# Altium schematic sheet Pyro-Other.SchDoc: Pyro / Buzzer / CAN
size A4; SheetNumber: 6; SheetTotal: 6
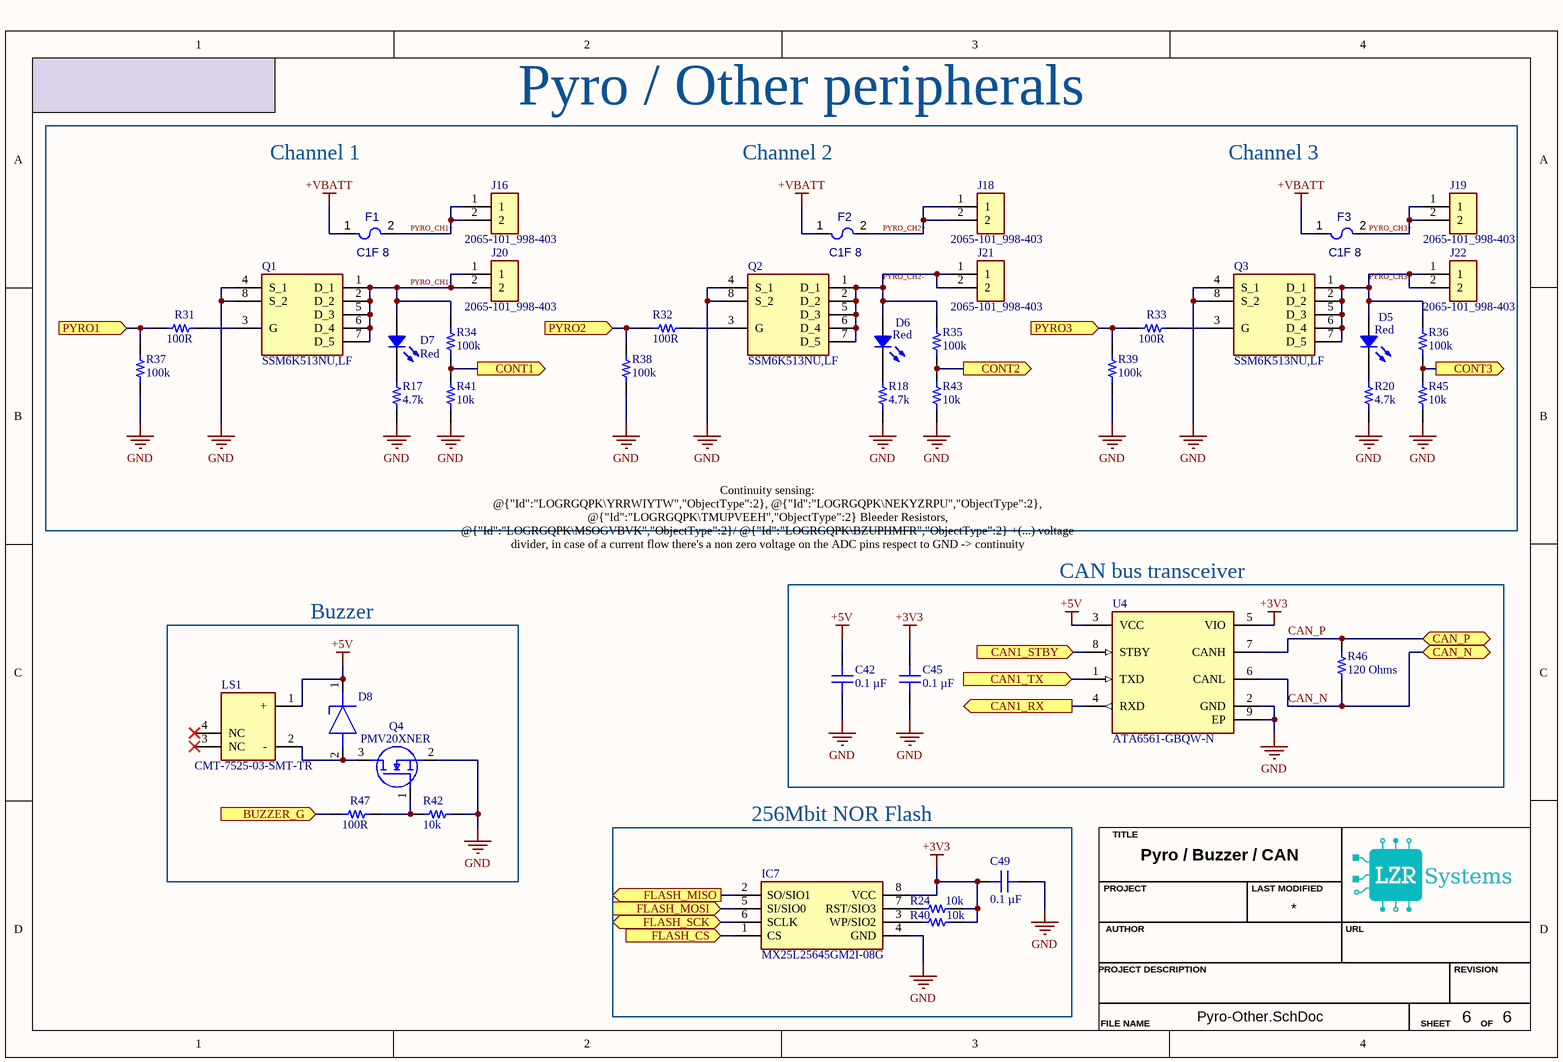
[diagram p0: Pyro-Other.SchDoc]

## Parts
C42  0.1 µF  [MURATA GCM155 0402_1005]
C45  0.1 µF  [MURATA GCM155 0402_1005]
C49  0.1 µF  [MURATA GCM155 0402_1005]
D5  Red  [LED 0402_1005 RED]
D6  Red  [LED 0402_1005 RED]
D7  Red  [LED 0402_1005 RED]
D8  PESD24VS1UA  [SOD2512X110N]  (value not drawn)
F1  C1F 8  [FP-3216FF-IPC_A]
F2  C1F 8  [FP-3216FF-IPC_A]
F3  C1F 8  [FP-3216FF-IPC_A]
IC7  MX25L25645GM2I-08G  [SOIC127P790X216-8N]
J16  2065-101_998-403  [2065101998403]
J18  2065-101_998-403  [2065101998403]
J19  2065-101_998-403  [2065101998403]
J20  2065-101_998-403  [2065101998403]
J21  2065-101_998-403  [2065101998403]
J22  2065-101_998-403  [2065101998403]
LS1  CMT-7525-03-SMT-TR  [CMT752503SMTTR]
Q1  SSM6K513NU,LF  [SSM6K513NULF]
Q2  SSM6K513NU,LF  [SSM6K513NULF]
Q3  SSM6K513NU,LF  [SSM6K513NULF]
Q4  PMV20XNER  [SOT95P230X110-3N]
R17  4.7k  [YAGEO RES 0402_1005]
R18  4.7k  [YAGEO RES 0402_1005]
R20  4.7k  [YAGEO RES 0402_1005]
R24  10k  [YAGEO RES 0402_1005]
R31  100R  [RES 0402_1005]
R32  100R  [RES 0402_1005]
R33  100R  [RES 0402_1005]
R34  100k  [YAGEO RES 0402_1005]
R35  100k  [YAGEO RES 0402_1005]
R36  100k  [YAGEO RES 0402_1005]
R37  100k  [YAGEO RES 0402_1005]
R38  100k  [YAGEO RES 0402_1005]
R39  100k  [YAGEO RES 0402_1005]
R40  10k  [YAGEO RES 0402_1005]
R41  10k  [YAGEO RES 0402_1005]
R42  10k  [YAGEO RES 0402_1005]
R43  10k  [YAGEO RES 0402_1005]
R45  10k  [YAGEO RES 0402_1005]
R46  120 Ohms  [KOA RES RK73 RN73 0603_1608]
R47  100R  [RES 0402_1005]
U4  ATA6561-GBQW-N  [FP-C04-21358-IPC_B]

## Blocks framed on the sheet
CAN bus transceiver: C42 C45 R46 U4
Buzzer: D8 LS1 Q4 R42 R47
256Mbit NOR Flash: C49 IC7 R24 R40

## Ports
BUZZER_G (in), CAN1_RX (out), CAN1_STBY (in), CAN1_TX (in), CAN_N (bidir), CAN_P (bidir), CONT1 (out), CONT2 (out), CONT3 (out), FLASH_CS (in), FLASH_MISO (out), FLASH_MOSI (in), FLASH_SCK (bidir), PYRO1 (in), PYRO2 (in), PYRO3 (in)

## Nets
+3V3: C45.1 C49.1 IC7.8(VCC) R24.1 R40.1 U4.5(VIO)
+5V: C42.1 D8.1(K) LS1.1(+) U4.3(VCC)
+VBATT: F1.1 F2.1 F3.1
GND: C42.2 C45.2 C49.2 IC7.4(GND) Q1.4(S_1) Q1.8(S_2) Q2.4(S_1) Q2.8(S_2) Q3.4(S_1) Q3.8(S_2) Q4.2(S) R17.1 R18.1 R20.1 R37.1 R38.1 R39.1 R41.1 R42.1 R43.1 R45.1 U4.2(GND) U4.9(EP)
BUZZER_G: R47.1 ; port BUZZER_G
CAN1_RX: U4.4(RXD) ; port CAN1_RX
CAN1_STBY: U4.8(STBY) ; port CAN1_STBY
CAN1_TX: U4.1(TXD) ; port CAN1_TX
CAN_N: R46.1 U4.6(CANL) ; port CAN_N
CAN_P: R46.2 U4.7(CANH) ; port CAN_P
CONT1: R34.1 R41.2 ; port CONT1
CONT2: R35.1 R43.2 ; port CONT2
CONT3: R36.1 R45.2 ; port CONT3
FLASH_CS: IC7.1(CS) ; port FLASH_CS
FLASH_MISO: IC7.2(SO/SIO1) ; port FLASH_MISO
FLASH_MOSI: IC7.5(SI/SIO0) ; port FLASH_MOSI
FLASH_SCK: IC7.6(SCLK) ; port FLASH_SCK
PYRO1: R31.1 R37.2 ; port PYRO1
PYRO2: R32.1 R38.2 ; port PYRO2
PYRO3: R33.1 R39.2 ; port PYRO3
PYRO_CH1+: F1.2 J16.1 J16.2
PYRO_CH1-: D7.1 J20.1 J20.2 Q1.1(D_1) Q1.2(D_2) Q1.5(D_3) Q1.6(D_4) Q1.7(D_5) R34.2
PYRO_CH2+: F2.2 J18.1 J18.2
PYRO_CH2-: D6.1 J21.1 J21.2 Q2.1(D_1) Q2.2(D_2) Q2.5(D_3) Q2.6(D_4) Q2.7(D_5) R35.2
PYRO_CH3+: F3.2 J19.1 J19.2
PYRO_CH3-: D5.1 J22.1 J22.2 Q3.1(D_1) Q3.2(D_2) Q3.5(D_3) Q3.6(D_4) Q3.7(D_5) R36.2
NetD5_2: D5.2 R20.2
NetD6_2: D6.2 R18.2
NetD7_2: D7.2 R17.2
NetD8_2: D8.2(A) LS1.2(-) Q4.3(D)
NetIC7_3: IC7.3(WP/SIO2) R40.2
NetIC7_7: IC7.7(RST/SIO3) R24.2
NetQ1_3: Q1.3(G) R31.2
NetQ2_3: Q2.3(G) R32.2
NetQ3_3: Q3.3(G) R33.2
NetQ4_1: Q4.1(G) R42.2 R47.2

Not connected (* = marked no-connect by the designer): LS1 3(NC)* 4(NC)*

## Notes on the sheet
- Pyro / Other peripherals
- Channel 1
- Channel 2
- Channel 3
- Continuity sensing:
  @{"Id":"LOGRGQPK\YRRWIYTW","ObjectType":2}, @{"Id":"LOGRGQPK\NEKYZRPU","ObjectType":2}, @{"Id":"LOGRGQPK\TMUPVEEH","ObjectType":2} Bleeder Resistors, @{"Id":"LOGRGQPK\MSOGVBVK","ObjectType":2}/ @{"Id":"LOGRGQPK\BZUPHMFR","ObjectType":2} +(...) voltage divider, in case of a current flow there's a non zero voltage on the ADC pins respect to GND -> continuity
- TITLE
- AUTHOR
- PROJECT
- LAST MODIFIED
- URL
- PROJECT DESCRIPTION
- REVISION
- FILE NAME
- SHEET
- OF

## Library data of the parts
C42 C45 C49 = GCM155R71H104ME02D: CAP CER 0.1UF 50V X7R 0402; manufacturer: Murata Electronics; Tolerance: ±20%; Part Number: GCM155R71H104ME02D; Capacitance: 0.1 µF; Applications: Automotive; componentlink1description: Datasheet; componentlink1url: https://psearch.en.murata.com/capacitor/product/GCM155R71H104ME02%23.pdf; componentlink2description: DigiKey Link; componentlink2url: https://www.digikey.com/en/products/detail/murata-electronics/GCM155R71H104ME02D/9867913; Device Package: 0402 (1005 Metric); lastupdated: 7/20/2024 2:04:19 AM; Lifecycle Status: Active; Minimum Order: 1; Mounting Type: Surface Mount, MLCC; Operating Temperature: -55°C ~ 125°C; Package / Case: 0402 (1005 Metric); packaging: TapeAndReel; partid: 39038; Part Status: Active; price: 0.01; Ratings: AEC-Q200; series: GCM; Size / Dimension: 0.039" L x 0.020" W (1.00mm x 0.50mm); Supplier 1: DigiKey; Supplier Part Number 1: 490-18204-1-ND; Temperature Coefficient: X7R; Thickness (Max): 0.022" (0.55mm); value: 0.1 µF; Voltage - Rated: 50V
D5-D7 = SM0402RC: LED RED CLEAR 0402 SMD; Manufacturer: Bivar Inc.; Configuration: 0402; Current - Test: 20mA; Lens Color: Colorless; Lens Size: 0.50mm x 1.00mm; Lens Style: Rectangle with Flat Top; Millicandela Rating: 90mcd; Viewing Angle: 130°; Voltage - Forward (Vf) (Typ): 2.1V; Wavelength - Dominant: 631nm; Wavelength - Peak: 645nm; Part Number: SM0402RC; Color: Red; ComponentLink1Description: Datasheet; ComponentLink1URL: https://www.bivar.com/Files/Datasheets/SM0402RC.pdf; ComponentLink2Description: DigiKey Link; ComponentLink2URL: https://www.digikey.com/en/products/detail/bivar-inc/SM0402RC/6810864; Device Package: 0402 (1005 Metric); Height (Max): 0.71mm; LastUpdated: 6/3/2024 7:59:17 PM; Lens Transparency: Clear; Lifecycle Status: Active; Minimum Order: 1; Mounting Type: Surface Mount; Package / Case: 0402 (1005 Metric); Packaging: TapeAndReel; PartId: 509; Part Status: Active; Price: 0.16; Series: -; Size / Dimension: 1.00mm L x 0.50mm W; Supplier 1: DigiKey; Supplier Part Number 1: 492-2208-1-ND; Supplier Device Package: 0402; Value: Red
D8 = PESD24VS1UA,115: Diode ESD (Uni-directional); Manufacturer_Name: Nexperia; Datasheet Link: https://assets.nexperia.com/documents/data-sheet/PESD24VS1UA.pdf; Height: 1.1mm; Manufacturer_Part_Number: PESD24VS1UA,115; Mouser Part Number: 771-PESD24VS1UA115; Mouser Price/Stock: https://www.mouser.co.uk/ProductDetail/Nexperia/PESD24VS1UA115?qs=A1cBxND5mHKZ%252BhkKKiwSEA%3D%3D; Arrow Part Number: PESD24VS1UA,115; Arrow Price/Stock: https://www.arrow.com/en/products/pesd24vs1ua115/nexperia
F1-F3 = CMP-005-00014-1: Fuse Chip Fast Acting 10A 24V SMD Solder Pad 1206 T/R CSA/UL/cULus; Case/Package: 1206; Current Rating: 10A; Pins: 2; Max Operating Temperature: 125°C; Min Operating Temperature: -55°C; Mounting Technology: Surface Mount
IC7 = MX25L25645GM2I-08G: Integrated Circuit; Manufacturer_Name: Macronix; Datasheet Link: https://www.farnell.com/datasheets/2815324.pdf; Height: 2.16mm; Manufacturer_Part_Number: MX25L25645GM2I-08G; Mouser Part Number: N/A; Mouser Price/Stock: https://www.mouser.co.uk/ProductDetail/Macronix/MX25L25645GM2I-08G?qs=Z%252BL2brAPG1Ifpgm4Amotqg%3D%3D; Arrow Part Number: MX25L25645GM2I-08G; Arrow Price/Stock: https://www.arrow.com/en/products/mx25l25645gm2i-08g/macronix-international?utm_currency=USD&region=nac
J16 J18-J22 = 2065-101_998-403: Connector; Manufacturer_Name: Wago; Manufacturer_Part_Number: 2065-101/998-403; Datasheet Link: https://www.farnell.com/datasheets/2849884.pdf?_gl=1*d6n7fb*_gcl_au*MTg5NzcyMzM3OS4xNzU0MjQ4OTUy; Height: 2.7mm
LS1 = CMT-7525-03-SMT-TR: Loudspeaker or Buzzer; Manufacturer_Name: Same Sky; Description: CMT-7525-03-SMT-TR - 7.5 mm; Datasheet Link: https://www.sameskydevices.com/product/resource/CMT-7525-03-SMT-TR.pdf; Height: 2.7mm; Manufacturer_Part_Number: CMT-7525-03-SMT-TR; Mouser Part Number: 179-CMT-7525-03SMTTR; Mouser Price/Stock: https://www.mouser.co.uk/ProductDetail/Same-Sky/CMT-7525-03-SMT-TR?qs=olJun0bQHM86ULzT6E8ouQ%3D%3D
Q1-Q3 = SSM6K513NU,LF: MOSFET (N-Channel); Manufacturer_Name: Toshiba; Datasheet Link: https://toshiba.semicon-storage.com/info/docget.jsp?did=53148&prodName=SSM6K513NU; Height: 0.8mm; Manufacturer_Part_Number: SSM6K513NU,LF; Mouser Part Number: 757-SSM6K513NULF; Mouser Price/Stock: https://www.mouser.co.uk/ProductDetail/Toshiba/SSM6K513NULF?qs=zPgndZZmKGbOGaIT7oO3Dw%3D%3D; Arrow Part Number: SSM6K513NU,LF; Arrow Price/Stock: https://www.arrow.com/en/products/ssm6k513nulf/toshiba?region=nac
Q4 = PMV20XNER: MOSFET (N-Channel); Manufacturer_Name: Nexperia; Datasheet Link: https://assets.nexperia.com/documents/data-sheet/PMV20XNE.pdf; Height: 1.1mm; Manufacturer_Part_Number: PMV20XNER; Mouser Part Number: 771-PMV20XNER; Mouser Price/Stock: https://www.mouser.co.uk/ProductDetail/Nexperia/PMV20XNER?qs=%252BRKXB2WKlSevPnXiP0DAaQ%3D%3D; Arrow Part Number: PMV20XNER; Arrow Price/Stock: https://www.arrow.com/en/products/pmv20xner/nexperia?utm_currency=USD&region=nac
R17 R18 R20 = AC0402FR-7W4K7L: RES 4.7K OHM 1% 1/8W 0402; Manufacturer: Yageo; Power (Watts): 0.125W, 1/8W; Resistance: 4.7 kOhms; Temperature Coefficient: ±100ppm/°C; Part Number: AC0402FR-7W4K7L; Value: 4.7k; ComponentLink1Description: Datasheet; ComponentLink1URL: https://www.yageo.com/upload/media/product/productsearch/datasheet/rchip/PYu-AC_51_RoHS_L_10.pdf; ComponentLink2Description: DigiKey Link; ComponentLink2URL: https://www.digikey.com/en/products/detail/yageo/AC0402FR-7W4K7L/17009027; Composition: Thick Film; Device Package: 0402 (1005 Metric); Features: Automotive AEC-Q200, Moisture Resistant; Height - Seated (Max): 0.015" (0.37mm); LastUpdated: 8/31/2025 3:03:39 PM; Lifecycle Status: Active; Minimum Order: 1; Number of Terminations: 2; Operating Temperature: -55°C ~ 155°C; Package / Case: 0402 (1005 Metric); Packaging: CutTape; PartId: 78681; Price: 0.01; Ratings: AEC-Q200; Series: AC; Size / Dimension: 0.039" L x 0.020" W (1.00mm x 0.50mm); Supplier 1: DigiKey; Supplier Part Number 1: 13-AC0402FR-7W4K7LCT-ND; Supplier Device Package: 0402; Tolerance: ±1%
R24 R40-R43 R45 = AC0402FR-1310KL: RES 10K OHM 1% 1/16W 0402; Manufacturer: Yageo; Power (Watts): 0.063W, 1/16W; Resistance: 10 kOhms; Temperature Coefficient: ±100ppm/°C; Part Number: AC0402FR-1310KL; Value: 10k; ComponentLink1Description: Datasheet; ComponentLink1URL: https://www.yageo.com/upload/media/product/productsearch/datasheet/rchip/PYu-AC_51_RoHS_L_8.pdf; ComponentLink2Description: DigiKey Link; ComponentLink2URL: https://www.digikey.com/en/products/detail/yageo/AC0402FR-1310KL/12756397; Composition: Thick Film; Device Package: 0402 (1005 Metric); Features: Automotive AEC-Q200, Moisture Resistant; Height - Seated (Max): 0.015" (0.37mm); LastUpdated: 8/31/2025 3:03:46 PM; Lifecycle Status: Active; Minimum Order: 1; Number of Terminations: 2; Operating Temperature: -55°C ~ 155°C; Package / Case: 0402 (1005 Metric); Packaging: CutTape; PartId: 69220; Part Status: Active; Price: 0.01; Ratings: AEC-Q200; Series: AC; Size / Dimension: 0.039" L x 0.020" W (1.00mm x 0.50mm); Supplier 1: DigiKey; Supplier Part Number 1: 13-AC0402FR-1310KLCT-ND; Supplier Device Package: 0402; Tolerance: ±1%
R31-R33 R47 = 504L1000FTNCFT: RES SMD 100 OHM 1% 1/8W 0402; Manufacturer: American Technical Ceramics; Power (Watts): 0.125W, 1/8W; Resistance: 100 Ohms; Temperature Coefficient: -50/ -150ppm/°C; Part Number: 504L1000FTNCFT; Value: 100R; ComponentLink1Description: Datasheet; ComponentLink1URL: http://www.atceramics.com/UserFiles/504L_ubr_resistor.pdf; ComponentLink2Description: DigiKey Link; ComponentLink2URL: http://digikey.com/product-detail/en/american-technical-ceramics/504L1000FTNCFT/1284-1327-1-ND/4789907; Composition: Thin Film; Device Package: 0402 (1005 Metric); Features: RF, High Frequency; Height - Seated (Max): 0.024" (0.60mm); LastUpdated: 2/9/2024 8:30:03 PM; Lifecycle Status: Active; Minimum Order: 1; Number of Terminations: 2; Operating Temperature: -40°C ~ 125°C; Package / Case: 0402 (1005 Metric); Packaging: TapeAndReel; PartId: 7485; Part Status: Active; Price: 1.53; Series: ATC504; Size / Dimension: 0.039" L x 0.020" W (1.00mm x 0.50mm); Supplier 1: DigiKey; Supplier Part Number 1: 1284-1327-1-ND; Supplier Device Package: 0402; Tolerance: ±1%
R34-R39 = AC0402FR-13100KL: RES 100K OHM 1% 1/16W 0402; Manufacturer: Yageo; Power (Watts): 0.063W, 1/16W; Resistance: 100 kOhms; Temperature Coefficient: ±100ppm/°C; Part Number: AC0402FR-13100KL; Value: 100k; ComponentLink1Description: Datasheet; ComponentLink1URL: https://www.yageo.com/upload/media/product/productsearch/datasheet/rchip/PYu-AC_51_RoHS_L_8.pdf; ComponentLink2Description: DigiKey Link; ComponentLink2URL: https://www.digikey.com/en/products/detail/yageo/AC0402FR-13100KL/14008459; Composition: Thick Film; Device Package: 0402 (1005 Metric); Features: Automotive AEC-Q200; Height - Seated (Max): 0.015" (0.37mm); LastUpdated: 8/31/2025 3:03:52 PM; Lifecycle Status: Active; Minimum Order: 1; Number of Terminations: 2; Operating Temperature: -55°C ~ 155°C; Package / Case: 0402 (1005 Metric); Packaging: CutTape; PartId: 65177; Part Status: Active; Price: 0.01; Ratings: AEC-Q200; Series: AC; Size / Dimension: 0.039" L x 0.020" W (1.00mm x 0.50mm); Supplier 1: DigiKey; Supplier Part Number 1: 13-AC0402FR-13100KLCT-ND; Supplier Device Package: 0402; Tolerance: ±1%
R46 = RK73H1JTTD1200F: RES 120 OHM 1% 1/8W 0603; Manufacturer: KOA Speer Electronics, Inc.; Power (Watts): 0.125W, 1/8W; Temperature Coefficient: ±100ppm/°C; Part Number: RK73H1JTTD1200F; Value: 120 Ohms; ComponentLink1Description: Datasheet; ComponentLink1URL: http://www.koaspeer.com/catimages/Products/RK73H/RK73H.pdf; ComponentLink2Description: DigiKey Link; ComponentLink2URL: https://www.digikey.com/en/products/detail/koa-speer-electronics-inc/RK73H1JTTD1200F/9844960; Composition: Thick Film; Device Package: 0603 (1608 Metric); Features: Automotive AEC-Q200; Height - Seated (Max): 0.022" (0.55mm); LastUpdated: 7/25/2024 9:43:06 AM; Lifecycle Status: Active; Minimum Order: 1; Number of Terminations: 2; Operating Temperature: -55°C ~ 155°C; Package / Case: 0603 (1608 Metric); Packaging: CutTape; PartId: 15761; Part Status: Active; Price: 0.01; Ratings: AEC-Q200; Resistance: 120 Ohms; Series: RK73H; Size / Dimension: 0.063" L x 0.031" W (1.60mm x 0.80mm); Supplier 1: DigiKey; Supplier Part Number 1: 2019-RK73H1JTTD1200FCT-ND; Supplier Device Package: 0603; Tolerance: ±1%
U4 = CMP-015-00008-1: Industrial Grade Can Trx With Vio Pin (Dfn8) Rohs Compliant: Yes; Min Supply Voltage: 4.5V; Max Supply Voltage: 5.5V; Min Operating Temperature: -40°C; Pins: 8; Max Operating Temperature: 150°C